# EAGLE design openusbfxs-dongle (EAGLE 5.03)
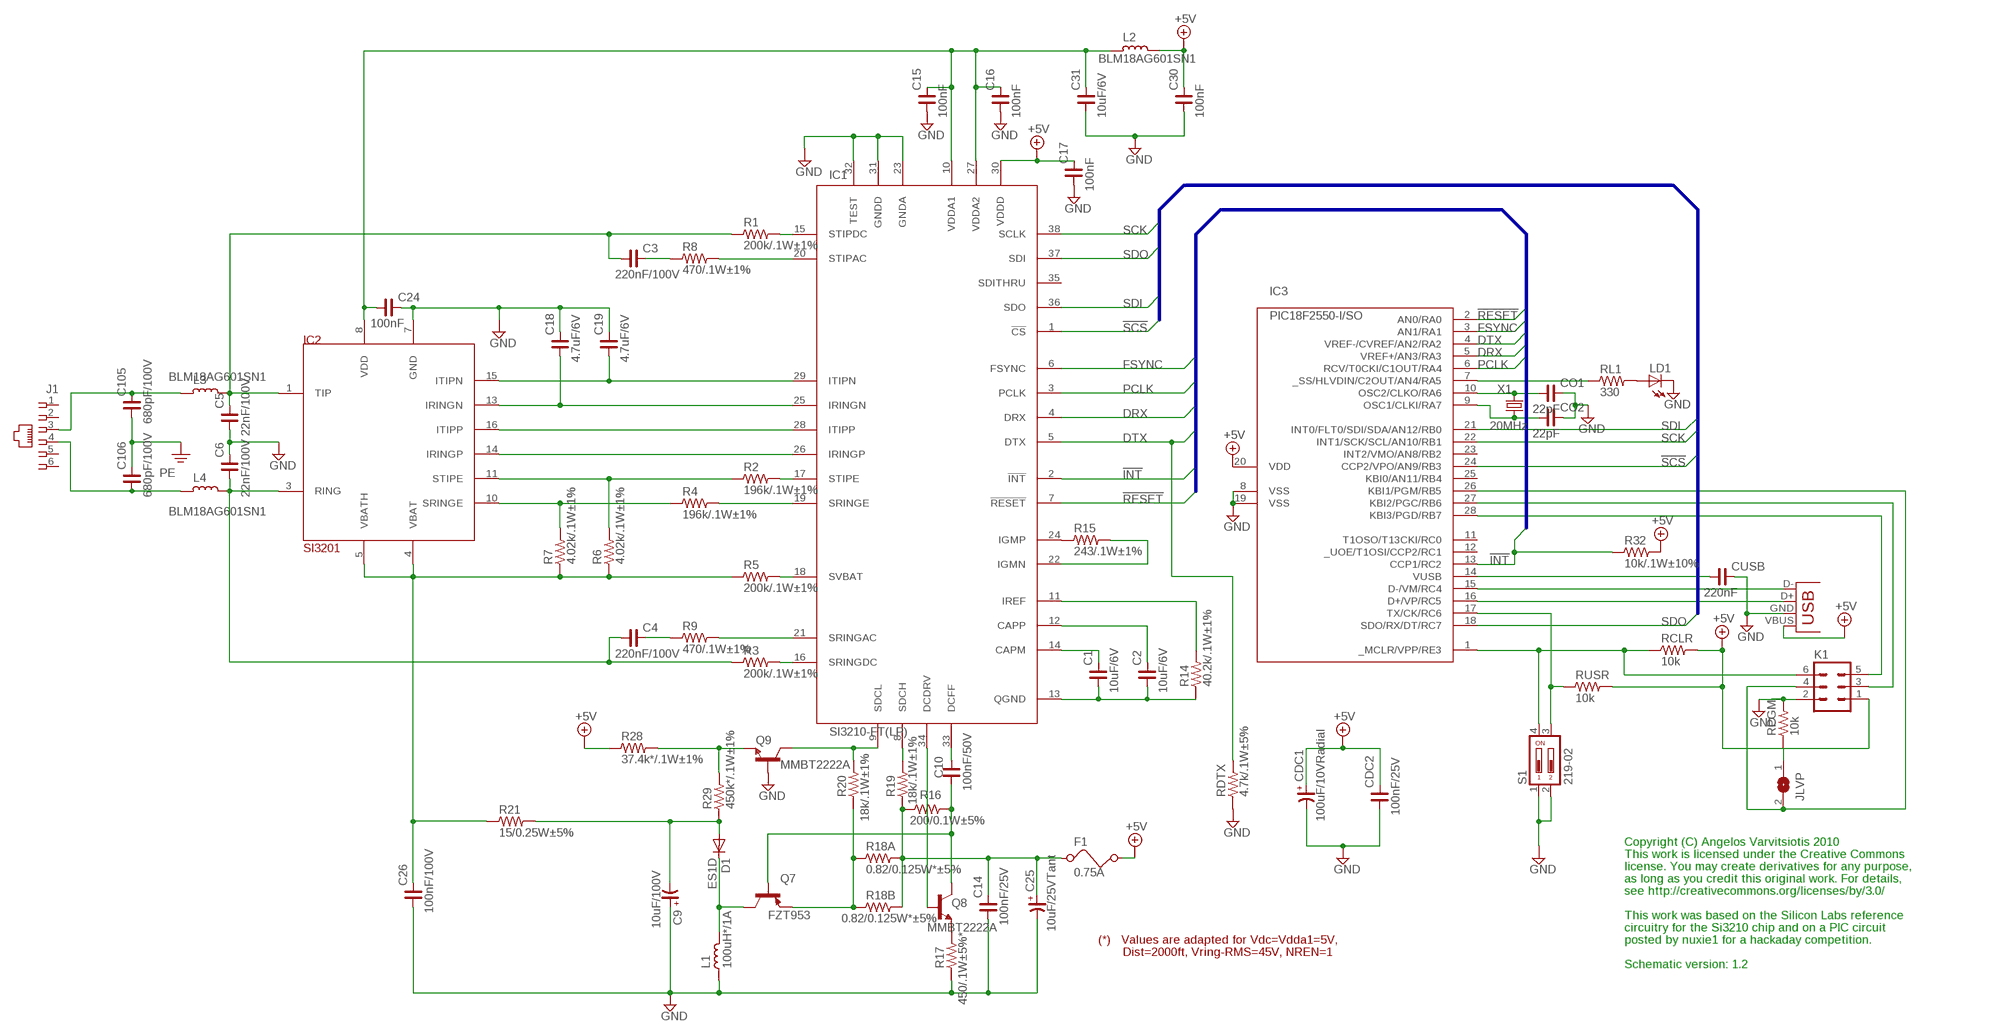
[diagram p0: schematic, sheet 1]

## Parts
C1  10uF/6V  C_1206  [C1206]
C2  10uF/6V  C_1206  [C1206]
C3  220nF/100V  C_1812  [C1812]
C4  220nF/100V  C_1812  [C1812]
C5  22nF/100V  C_1206  [C1206]
C6  22nF/100V  C_1206  [C1206]
C9  10uF/100V  CP_E-025X060  [CE-025X060]
C10  100nF/50V  C_1210  [C1210]
C14  100nF/25V  C_1210  [C1210]
C15  100nF  C_0603  [C0603]
C16  100nF  C_0603  [C0603]
C17  100nF  C_0603  [C0603]
C18  4.7uF/6V  C_1206  [C1206]
C19  4.7uF/6V  C_1206  [C1206]
C24  100nF  C_0603  [C0603]
C25  10uF/25VTant  CP_TT025-040  [CTT-025-040]
C26  100nF/100V  C_1210  [C1210]
C30  100nF  C_0603  [C0603]
C31  10uF/6V  C_1206  [C1206]
C105  680pF/100V  C_1206  [C1206]
C106  680pF/100V  C_1206  [C1206]
CDC1  100uF/10VRadial  CP_E-025X060  [CE-025X060]
CDC2  100nF/25V  C_1206  [C1206]
CO1  22pF  C_1206  [C1206]
CO2  22pF  C_1206  [C1206]
CUSB  220nF  C_1206  [C1206]
D1  ES1D  ES2D  [SMB]
F1  0.75A  FUSED  [1210]
IC1  SI3210-FT(LP)  [TSSOP38-LP]
IC2  SI3201  [ESOIC-16T]
IC3  PIC18F2550-I/SO  [SO-28W]
J1  RJ-11/12TH  [RJ-11/12]
JLVP  SJ  [SJ]
K1  MA03-2  [MA03-2]
L1  100uH*/1A  L_  [SMD_SC]
L2  BLM18AG601SN1  L_0603  [L0603]
L3  BLM18AG601SN1  L_0603  [L0603]
L4  BLM18AG601SN1  L_0603  [L0603]
LD1  LEDCHIPLED_1206  [CHIPLED_1206]
Q7  FZT953  PNP_SOT-223  [SOT230P700X160-4N]
Q8  MMBT2222A  NPN_SOT-23  [SOT95P280X135-3N]
Q9  MMBT2222A  NPN_SOT-23  [SOT95P280X135-3N]
R1  200k/.1W±1%  R_0805  [R0805]
R2  196k/.1W±1%  R_0805  [R0805]
R3  200k/.1W±1%  R_0805  [R0805]
R4  196k/.1W±1%  R_0805  [R0805]
R5  200k/.1W±1%  R_0805  [R0805]
R6  4.02k/.1W±1%  R_0805  [R0805]
R7  4.02k/.1W±1%  R_0805  [R0805]
R8  470/.1W±1%  R_0805  [R0805]
R9  470/.1W±1%  R_0805  [R0805]
R14  40.2k/.1W±1%  R_0805  [R0805]
R15  243/.1W±1%  R_0805  [R0805]
R16  200/0.1W±5%  R_0805  [R0805]
R17  450/.1W±5%*  R_0805  [R0805]
R18A  0.82/0.125W*±5%  R_1206  [R1206]
R18B  0.82/0.125W*±5%  R_1206  [R1206]
R19  18k/.1W±1%  R_0805  [R0805]
R20  18k/.1W±1%  R_0805  [R0805]
R21  15/0.25W±5%  R_1206  [R1206]
R28  37.4k*/.1W±1%  R_0805  [R0805]
R29  450k*/.1W±1%  R_0805  [R0805]
R32  10k/.1W±10%  R_0805  [R0805]
RCLR  10k  R_0805  [R0805]
RDTX  4.7k/.1W±5%  R_0805  [R0805]
RL1  330  R_1206  [R1206]
RPGM  10k  R_0805  [R0805]
RUSR  10k  R_0805  [R0805]
S1  219-02  [CTS-219-02]
U1  USB-A-H  [USB-A-H]
X1  20MHz  CRYTALHC49S  [HC49/S]

## Nets
!INT: IC1.2(!INT) IC3.13(CCP1/RC2) R32.1
!RESET: IC1.7(!RESET) IC3.2(AN0/RA0)
!SCS: IC1.1(!CS) IC3.24(CCP2/VPO/AN9/RB3)
+5V: C17.2 C30.2 CDC1.+ CDC2.2 F1.2 IC1.30(VDDD) IC3.20(VDD) K1.1 L2.1 R28.1 R32.2 RCLR.2 RUSR.2 U1.VBUS(GND)
\MCLR/VPP: IC3.1(_MCLR/VPP/RE3) K1.6 RCLR.1 S1.4
D+: IC3.16(D+/VP/RC5) U1.D+(D-)
D-: IC3.15(D-/VM/RC4) U1.D-(D+)
DCDRV: IC1.34(DCDRV) Q8.1(B)
DCFF: C10.2 IC1.33(DCFF)
DRX: IC1.4(DRX) IC3.5(VREF+/AN3/RA3)
DTX: IC1.5(DTX) IC3.4(VREF-/CVREF/AN2/RA2) RDTX.2
FSYNC: IC1.6(FSYNC) IC3.3(AN1/RA1)
GND: C5.1 C6.2 C9.+ C14.1 C15.1 C16.1 C17.1 C18.2 C19.2 C24.2 C25.- C26.1 C30.1 C31.1 C105.1 C106.2 CDC1.- CDC2.1 CO1.2 CO2.2 CUSB.2 IC1.23(GNDA) IC1.31(GNDD) IC1.32(TEST) IC2.7(GND) IC3.8(VSS) IC3.19(VSS) K1.2 L1.P$2 LD1.C Q9.1(B) R17.1 RDTX.1 RPGM.2 S1.1 S1.2 U1.GND(VBUS) ; supply symbol labelled PE
IRINGN: C18.1 IC1.25(IRINGN) IC2.13(IRINGN)
IRINGP: IC1.26(IRINGP) IC2.14(IRINGP)
ITIPN: C19.1 IC1.29(ITIPN) IC2.15(ITIPN)
ITIPP: IC1.28(ITIPP) IC2.16(ITIPP)
N$1: IC1.15(STIPDC) R1.2
N$2: IC1.17(STIPE) R2.2
N$3: IC1.18(SVBAT) R5.2
N$4: IC1.19(SRINGE) R4.2
N$5: IC1.16(SRINGDC) R3.2
N$13: IC1.20(STIPAC) R8.2
N$14: IC1.21(SRINGAC) R9.2
N$15: LD1.A RL1.2
N$18: C1.1 C2.1 IC1.13(QGND) R14.1
N$19: C1.2 IC1.14(CAPM)
N$20: C2.2 IC1.12(CAPP)
N$21: IC1.11(IREF) R14.2
N$22: C3.2 R8.1
N$23: C4.2 R9.1
N$24: IC1.24(IGMP) R15.1
N$25: Q8.2(E) R17.2
N$26: C9.- D1.A R21.2 R29.1
N$27: Q9.2(E) R28.2 R29.2
N$30: Q7.3(E) R18A.1 R18B.1 R20.1
N$36: C10.1 Q7.1(B) Q8.3(C) R16.2
N$37: D1.C L1.P$1 Q7.2(C)
N$42: JLVP.1 RPGM.1
N$43: CO1.1 IC3.10(OSC2/CLKO/RA6) X1.2
N$44: CO2.1 IC3.9(OSC1/CLKI/RA7) X1.1
N$45: CUSB.1 IC3.14(VUSB)
N$46: C105.2 J1.3 L3.2
N$47: C106.1 J1.4 L4.2
N$48: IC3.7(_SS/HLVDIN/C2OUT/AN4/RA5) RL1.1
N$50: IC3.17(TX/CK/RC6) RUSR.1 S1.3
PCLK: IC1.3(PCLK) IC3.6(RCV/T0CKI/C1OUT/RA4)
PGC: IC3.27(KBI2/PGC/RB6) K1.3
PGD: IC3.28(KBI3/PGD/RB7) K1.5
PGM: IC3.26(KBI1/PGM/RB5) JLVP.2 K1.4
R15: IC1.22(IGMN) R15.2
SCK: IC1.38(SCLK) IC3.22(INT1/SCK/SCL/AN10/RB1)
SDCH: IC1.8(SDCH) R19.2
SDCL: IC1.9(SDCL) Q9.3(C) R20.2
SDI: IC1.36(SDO) IC3.21(INT0/FLT0/SDI/SDA/AN12/RB0)
SDO: IC1.37(SDI) IC3.18(SDO/RX/DT/RC7)
SRINGDC: C4.1 C6.1 IC2.3(RING) L4.1 R3.1
SRINGE: IC2.10(SRINGE) R4.1 R7.2
STIPDC: C3.1 C5.2 IC2.1(TIP) L3.1 R1.1
STIPE: IC2.11(STIPE) R2.1 R6.2
VANALOG: C15.2 C16.2 C24.1 C31.2 IC1.10(VDDA1) IC1.27(VDDA2) IC2.8(VDD) L2.2
VBAT: C26.2 IC2.4(VBAT) IC2.5(VBATH) R5.1 R6.1 R7.1 R21.1
VUNREG: C14.2 C25.+ F1.1 R16.1 R18A.2 R18B.2 R19.1
Unconnected: IC1.35(SDITHRU) IC3.11(T1OSO/T13CKI/RC0) IC3.12(_UOE/T1OSI/CCP2/RC1) IC3.23(INT2/VMO/AN8/RB2) IC3.25(KBI0/AN11/RB4) J1.1 J1.2 J1.5 J1.6

## Buses
SPI:SDI,SDO,SCK,!SCS
PCM:FSYNC,PCLK,DRX,DTX,!RESET,!INT

## Notes on the sheet
- Copyright (C) Angelos Varvitsiotis 2010
- This work is licensed under the Creative Commons
- license. You may create derivatives for any purpose,
- as long as you credit this original work. For details,
- see http://creativecommons.org/licenses/by/3.0/
- This work was based on the Silicon Labs reference
- circuitry for the Si3210 chip and on a PIC circuit
- (*)   Values are adapted for Vdc=Vdda1=5V, | posted by nuxie1 for a hackaday competition.
- Dist=2000ft, Vring-RMS=45V, NREN=1
- Schematic version: 1.2

## Library data of the parts
C1-C6 C10 C14-C19 C24 C26 C30 C31 C105 C106 CDC2 CO1 CO2 CUSB = rc-master:C_: NON-POLARIZED CAP
C9 C25 CDC1 = rc-master:CP_: POLARIZED CAP
D1 = diode:ES2D: DIODE super fast rectifier, 2 A
F1 = m-pad-2.0:FUSE: Fuse's in various packages
IC1 = SilabsProSLIC:SI3210: Si3210 ProSLIC® IC Silicon Labs Si3210 ProSLIC® IC; DC-DC_TYPE: BJT; ROHS: YES
IC2 = SilabsProSLIC:SI3201: Si3201 Linefeed Interface IC Silicon Labs 3201 Linefeed Interface IC
IC3 = microchip-pic18fxx5x:PIC18*2550: PIC18*2550 Microchip FLASH Microcontroller with FS-USB DEVICE FEATURES Feature PIC18*2550 Program Memory (bytes) 32k Program Memory (instructions) 16384 I/O Ports Ports A, B, C, (E) Capture/Compare/PWM Modules 2 Enhanced Capture/Compare/PWM Modules 0 Parallel Communications (PSP) No 10-bit Analog-to-Digital Module 10 input Channels Package Types 28-pin PDIP 28-pin SOIC NOTES: F only after 18, means standard voltage range from 4.2v to 5.5v LF after 18, means extended voltage range from 2.0v to 5.5v T after entire device number, means supplied in tape and reel TQFP packages only -E before / denotes extended temperature range from -40°C to +120°C -I before / denotes industrial temperature range from -40°C to +85°C /PT suffix denotes TQFP package /SO suffix denotes SOIC package /SP suffix denotes Skinny Plastic DIP package /P suffix denotes Plastic DIP package /ML suffix denotes QFN package
J1 = connectors:RJ-11/12: 6 Pin RJ-12 Connector Digikey Part Number: A9031-ND
JLVP = jumper:SJ: SMD solder JUMPER
K1 = con-lstb:MA03-2: PIN HEADER
L1 = ShieldedChoke:L_: INDUCTOR
L2-L4 = rc-master:L_: INDUCTOR
LD1 = led:LED: LED OSRAM: - CHIPLED LG R971, LG N971, LY N971, LG Q971, LY Q971, LO R971, LY R971 LH N974, LH R974 LS Q976, LO Q976, LY Q976 LO Q996 - Hyper CHIPLED LW Q18S LB Q993, LB Q99A, LB R99A - SideLED LS A670, LO A670, LY A670, LG A670, LP A670 LB A673, LV A673, LT A673, LW A673 LH A674 LY A675 LS A676, LA A676, LO A676, LY A676, LW A676 LS A679, LY A679, LG A679 - Hyper Micro SIDELED® LS Y876, LA Y876, LO Y876, LY Y876 LT Y87S - SmartLED LW L88C, LW L88S LB L89C, LB L89S, LG L890 LS L89K, LO L89K, LY L89K LS L896, LA L896, LO L896, LY L896 - TOPLED LS T670, LO T670, LY T670, LG T670, LP T670 LSG T670, LSP T670, LSY T670, LOP T670, LYG T670 LG T671, LOG T671, LSG T671 LB T673, LV T673, LT T673, LW T673 LH T674 LS T676, LA T676, LO T676, LY T676, LB T676, LH T676, LSB T676, LW T676 LB T67C, LV T67C, LT T67C, LS T67K, LO T67K, LY T67K, LW E67C LS E67B, LA E67B, LO E67B, LY E67B, LB E67C, LV E67C, LT E67C LW T67C LS T679, LY T679, LG T679 LS T770, LO T770, LY T770, LG T770, LP T770 LB T773, LV T773, LT T773, LW T773 LH T774 LS E675, LA E675, LY E675, LS T675 LS T776, LA T776, LO T776, LY T776, LB T776 LHGB T686 LT T68C, LB T68C - Hyper Mini TOPLED® LB M676 - Mini TOPLED Santana® LG M470 LS M47K, LO M47K, LY M47K Source: http://www.osram.convergy.de LUXEON: - LUMILED® LXK2-PW12-R00, LXK2-PW12-S00, LXK2-PW14-U00, LXK2-PW14-V00 LXK2-PM12-R00, LXK2-PM12-S00, LXK2-PM14-U00 LXK2-PE12-Q00, LXK2-PE12-R00, LXK2-PE12-S00, LXK2-PE14-T00, LXK2-PE14-U00 LXK2-PB12-K00, LXK2-PB12-L00, LXK2-PB12-M00, LXK2-PB14-N00, LXK2-PB14-P00, LXK2-PB14-Q00 LXK2-PR12-L00, LXK2-PR12-M00, LXK2-PR14-Q00, LXK2-PR14-R00 LXK2-PD12-Q00, LXK2-PD12-R00, LXK2-PD12-S00 LXK2-PH12-R00, LXK2-PH12-S00 LXK2-PL12-P00, LXK2-PL12-Q00, LXK2-PL12-R00 Source: www.luxeon.com KINGBRIGHT: KA-3528ASYC Source: www.kingbright.com
Q7 = ipc-7351-transistor:PNP_
Q8 Q9 = ipc-7351-transistor:NPN_
R1-R9 R14-R17 R18A R18B R19-R21 R28 R29 R32 RCLR RDTX RL1 RPGM RUSR = rc-master:R_: RESISTOR
S1 = switch-dil:219-02*: Surface Mount DIP Switch Series 219 SMT CTS Electronic Components Sourc: www.ctscorp.com
U1 = SparkFun:USB: USB Connectors USB-B-PTH is fully proven SKU : PRT-00139 USB-miniB is fully proven SKU : PRT-00587 USB-A-PCB is untested. USB-A-H is throughly reviewed, but untested. Spark Fun Electronics SKU : PRT-00437 USB-B-SMT is throughly reviewed, but untested. Needs silkscreen touching up. USB-A-S has not been used/tested USB-MB-H has not been used/tested
X1 = crystal:CRYTAL: CRYSTAL

## Board
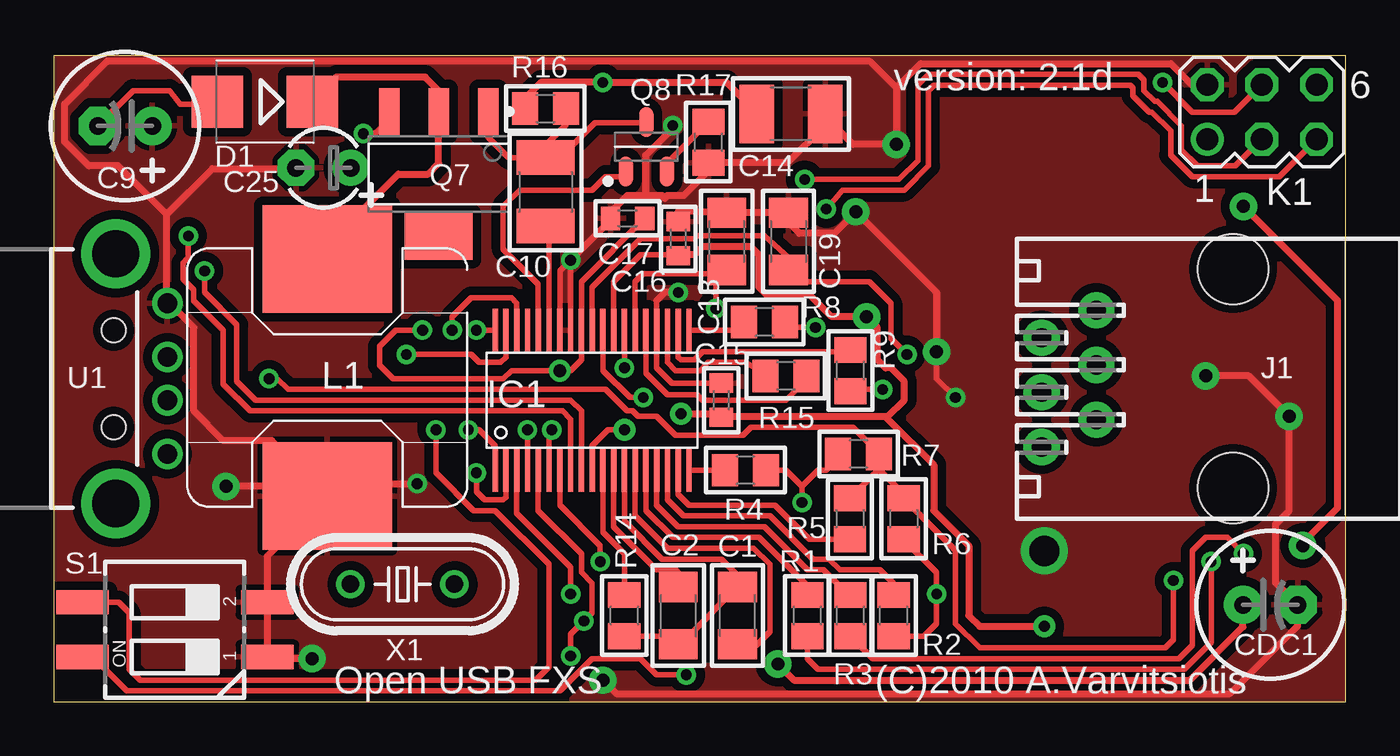
[diagram p1: board, top side]
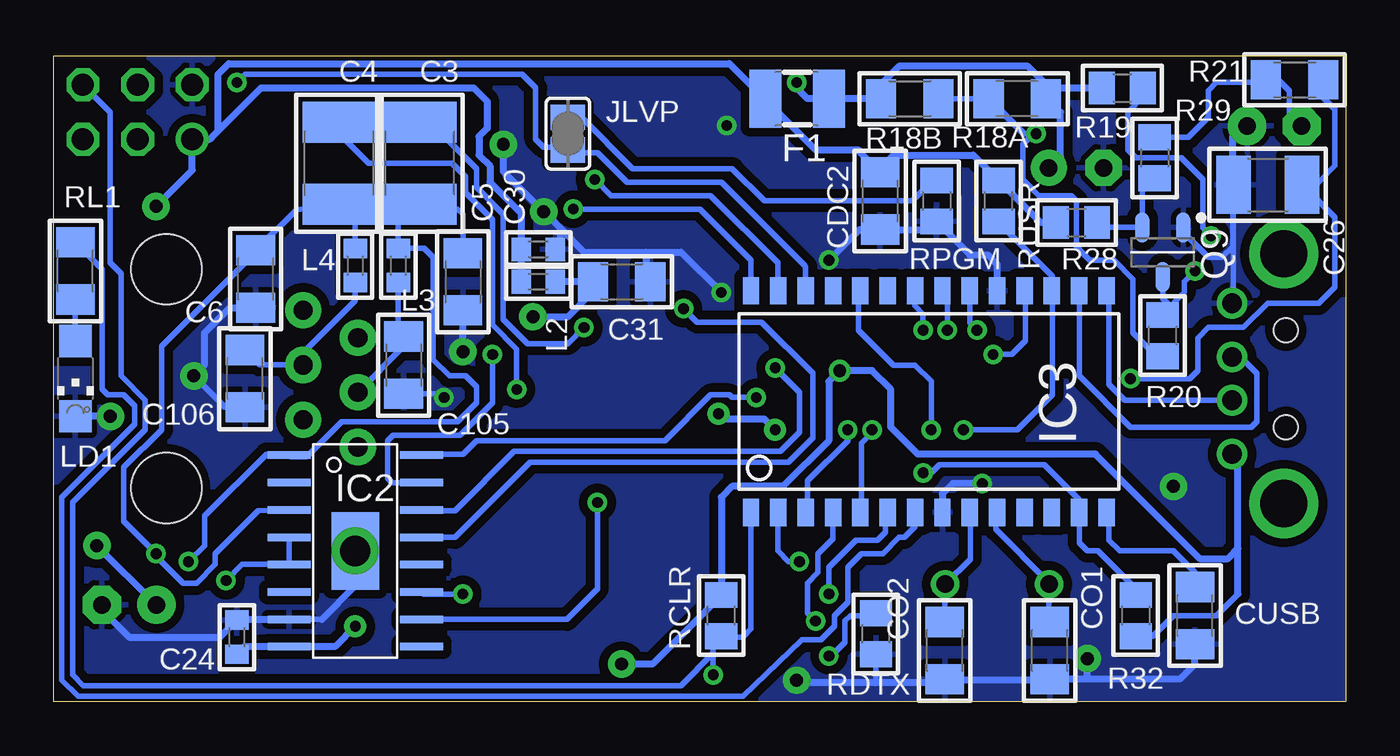
[diagram p2: board, bottom side, seen from below]

Size 60 x 30 mm. Coordinates in mm from the lower left corner, seen from the top.
Outline: 0,0 60,0 60,30 0,30 0,0
Copper layers (1*16): Top 0.035mm / dielectric 1.5mm / Bottom 0.035mm
Design rules "default *": minimum track width 0.25mm, minimum drill 0.5mm, track to track 8mil, track to pad 8mil, pad to pad 8mil, via to via 8mil, smd to smd 8mil, copper to edge 0mil, drill to drill 0.4mm, minimum pad ring 10mil, minimum via ring 8mil, stop-mask expansion 4mil, vias tented up to drill 0mil, thermal gap 10mil

### Footprints (pad centres in the part's own frame; a part is rotated, then mirrored left to right if it is on the bottom)
C1206 = smd 1.4 x 1.8: 1 -1.329,0; 2 1.329,0
C1812 = smd 1.905 x 3.404: 1 -1.905,0; 2 1.905,0
CE-025X060 = drill 0.813 pad 1.778 round: + -1.27,0 | drill 0.813 pad 1.778 octagon: - 1.27,0
C1210 = smd 1.6 x 2.7: 1 -1.587,0; 2 1.587,0
C0603 = smd 0.9 x 1.1: 1 -0.794,0; 2 0.794,0
CTT-025-040 = drill 0.813 pad 1.676 round: + -1.27,0 | drill 0.813 pad 1.676 octagon: - 1.27,0
SMB = smd 2.4 x 2.4: A 2.2,0; C -2.2,0
1210 = smd 1.5 x 2.7: 1 -1.5,0; 2 1.45,0
TSSOP38-LP = smd 0.25 x 2: 1 -4.5,-3.25; 2 -4,-3.25; 3 -3.5,-3.25; 4 -3,-3.25; 5 -2.5,-3.25; 6 -2,-3.25; 7 -1.5,-3.25; 8 -1,-3.25; 9 -0.5,-3.25; 10 0,-3.25; 11 0.5,-3.25; 12 1,-3.25; 13 1.5,-3.25; 14 2,-3.25; 15 2.5,-3.25; 16 3,-3.25; 17 3.5,-3.25; 18 4,-3.25; 19 4.5,-3.25; 20 4.5,3.25; 21 4,3.25; 22 3.5,3.25; 23 3,3.25; 24 2.5,3.25; 25 2,3.25; 26 1.5,3.25; 27 1,3.25; 28 0.5,3.25; 29 0,3.25; 30 -0.5,3.25; 31 -1,3.25; 32 -1.5,3.25; 33 -2,3.25; 34 -2.5,3.25; 35 -3,3.25; 36 -3.5,3.25; 37 -4,3.25; 38 -4.5,3.25
ESOIC-16T = smd 0.35 x 2: 1 -4.445,-3.075; 2 -3.175,-3.075; 3 -1.905,-3.075; 4 -0.635,-3.075; 5 0.635,-3.075; 6 1.905,-3.075; 7 3.175,-3.075; 8 4.445,-3.075; 9 4.445,3.075; 10 3.175,3.075; 11 1.905,3.075; 12 0.635,3.075; 13 -0.635,3.075; 14 -1.905,3.075; 15 -3.175,3.075; 16 -4.445,3.075 | smd 3.6 x 2.2: THERMAL 0,0
SO-28W = smd 0.762 x 1.27: 1 -7.62,-5.207; 2 -6.35,-5.207; 3 -5.08,-5.207; 4 -3.81,-5.207; 5 -2.54,-5.207; 6 -1.27,-5.207; 7 0,-5.207; 8 1.27,-5.207; 9 2.54,-5.207; 10 3.81,-5.207; 11 5.08,-5.207; 12 6.35,-5.207; 13 7.62,-5.207; 14 8.89,-5.207; 15 8.89,5.08; 16 7.62,5.08; 17 6.35,5.08; 18 5.08,5.08; 19 3.81,5.08; 20 2.54,5.08; 21 1.27,5.08; 22 0,5.08; 23 -1.27,5.08; 24 -2.54,5.08; 25 -3.81,5.08; 26 -5.08,5.08; 27 -6.35,5.08; 28 -7.62,5.08
RJ-11/12 = drill 0.889 pad 1.676 round: 1 -3.175,7.747; 2 -1.905,5.207; 3 -0.635,7.747; 4 0.635,5.207; 5 1.905,7.747; 6 3.175,5.207 | hole 3.251: -5.08,-1.143; 5.08,-1.143
SJ = smd 1.168 x 1.6: 1 -0.762,0; 2 0.762,0
MA03-2 = drill 1.016 round: 1 -2.54,-1.27 | drill 1.016 octagon: 2 -2.54,1.27; 3 0,-1.27; 4 0,1.27; 5 2.54,-1.27; 6 2.54,1.27
SMD_SC = smd 5 x 6: P$1 -5.5,0; P$2 5.5,0
L0603 = smd 0.9 x 1.1: 1 -0.794,0; 2 0.794,0
CHIPLED_1206 = smd 1.5 x 1.5: A 0,-1.75; C 0,1.75
SOT230P700X160-4N = smd 2.15 x 0.95: 1 -2.9,2.3; 2 -2.9,0; 3 -2.9,-2.3 | smd 2.15 x 3.15: 4 2.9,0
SOT95P280X135-3N = smd 1.4 x 0.65: 1 -1.15,0.95; 2 -1.15,-0.95; 3 1.15,0
R0805 = smd 1.2 x 1.5: 1 -0.953,0; 2 0.953,0
R1206 = smd 1.4 x 1.8: 1 -1.329,0; 2 1.329,0
CTS-219-02 = smd 1.13 x 2.44: 1 -1.27,-4.3; 2 1.27,-4.3; 3 1.27,4.3; 4 -1.27,4.3
USB-A-H = drill 0.914 round: D+ 2.4,1; D- 2.4,-1; GND 2.4,3.5; VBUS 2.4,-3.5 | drill 2.2 round: GND@1 0,5.8; GND@2 0,-5.8 | hole 1.1: -0.1,2.25; -0.1,-2.25
HC49/S = drill 0.813 round: 1 -2.413,0; 2 2.413,0

### Placement (x,y rotation side)
C1  31.75,4 270 top
C2  29,4 90 top
C3  43,25 90 bottom
C4  46.75,25 90 bottom
C5  41,19.5 90 bottom
C6  50.62,19.62 270 bottom
C9  3.31,26.73 180 top
C10  22.84,23.67 270 top
C14  34.24,27.29 180 top
C15  31,14 270 top
C16  29,21.5 270 top
C17  26.65,22.44 0 top
C18  31.25,21.38 90 top
C19  34.12,21.38 90 top
C24  51.5,3 90 bottom
C25  12.52,24.79 180 top
C26  3.62,24 0 bottom
C30  37.5,21 180 bottom
C31  33.62,19.5 180 bottom
C105  43.75,15.62 90 bottom
C106  51.12,15 270 bottom
CDC1  56.5,4.5 0 top
CDC2  21.62,23.25 90 bottom
CO1  13.75,2.38 270 bottom
CO2  18.62,2.38 270 bottom
CUSB  7,4 270 bottom
D1  9.8,27.86 180 top
F1  25.5,28 180 bottom
IC1  25,14 0 top
IC2  46,7 270 bottom
IC3  20,14 0 bottom
J1  53.62,15 90 top
JLVP  36.12,26.38 270 bottom
K1  56.11,27.38 0 top
L1  12.7,15.05 270 top
L2  37.5,19.5 0 bottom
L3  44,20.25 270 bottom
L4  46,20.25 270 bottom
LD1  59,15 180 bottom
Q7  17.88,24.5 270 top
Q8  27.52,25.77 90 top
Q9  8.5,20.88 270 bottom
R1  35,4 90 top
R2  39,4 90 top
R3  37,4 90 top
R4  32.12,10.75 180 top
R5  36.98,8.49 270 top
R6  39.47,8.49 270 top
R7  37.38,11.5 180 top
R8  33,17.62 180 top
R9  37,15.38 90 top
R14  26.5,4 90 top
R15  34,15.12 180 top
R16  22.84,27.54 0 top
R17  30.41,25.98 90 top
R18A  15.25,28 0 bottom
R18B  20.25,28 180 bottom
R19  10.38,28.5 0 bottom
R20  8.5,17 90 bottom
R21  2.38,28.88 180 bottom
R28  12.5,22.25 0 bottom
R29  8.88,25.25 270 bottom
R32  9.75,4 270 bottom
RCLR  29,4 90 bottom
RDTX  21.82,3.15 90 bottom
RL1  59,20 270 bottom
RPGM  19,23.25 270 bottom
RUSR  16.12,23.25 90 bottom
S1  5.62,3.35 90 top
U1  2.88,15 0 top
X1  16.2,5.46 180 top

### Tracks (layer width: path | path; a pad name or v marks a point on that pad's centre or on a via)
!INT  (via drill 0.5)
  Top 0.25: IC1.2 21,9.5 20.88,9.38 20,9.38 19.62,9.75 v19.62,10.62
  Bottom 0.25: R32.1 9.75,5.25 11.5,7 12,7 12.38,7.38 IC3.13 12.38,9.38 14,11 18.88,11 19.25,10.62 v19.62,10.62
!RESET  (via drill 0.5)
  Top 0.25: IC1.7 23.5,9.12 25.38,7.25 v25.38,6.5
  Bottom 0.25: IC3.2 26.38,8.77 26.38,7 25.88,6.5 v25.38,6.5
!SCS  (via drill 0.5 pad 0.25)
  Top 0.25: IC1.1 20.5,11.88 19.75,12.62 v19.25,12.62
  Bottom 0.25: IC3.24 22.62,19 22.62,18.5 22.62,17.25 21,15.62 20,15.62 19.25,14.88 v19.25,12.62
+5V  (via drill 0.5, 0.6 pad 1.02, 0.6 pad 1.27)
  Top 0.25: C17.2 24.5,19.5 IC1.30 24.5,15.88 24,15.38 v23.5,15.38 21.25,15.38 20.88,15 15.75,15 15.12,15.62 15.12,16.5 15.88,17.25 v17.12,17.25
  Top 0.33: v33.62,1.75 34.38,1 52.75,1 55.23,3.48 CDC1.+ | v55.25,23 59.62,18.62 59.62,9 58,7.38 v58,7.25
  Bottom 0.25: IC3.20 17.46,17.59 v17.12,17.25 | 5,5 6,4 8,4 8.95,3.05 R32.2 | 21.67,24.62 CDC2.2 | F1.2 26.95,27.7 | K1.1 53.55,26.12
  Bottom 0.33: v55.25,23 53.62,24.62 53.57,24.68 K1.1 | R28.1 14.17,22.25 RUSR.2 17.3,25.38 21,25.38 21.62,24.75 CDC2.2 | v33.62,1.75 32.2,1.75 RCLR.2 29,9.5 28.5,10 26.12,10 24,12.12 24,14.88 v23.5,15.38 22,15.38 21.12,14.5 21.12,12.75 19.88,11.5 11.62,11.5 6.75,6.62 5.5,6.62 5,7.12 | U1.VBUS 5,11.22 5,7.12 | 5,5 5,7.12 | 21.67,24.62 22.62,25.58 22.62,25.62 24.62,25.62 26.95,27.95 F1.2 27,28 28.62,29.62 51.88,29.62 52.38,29.12 52.38,26.5 52.5,26.38 | 53.55,26.12 52.75,26.12 52.5,26.38 | L2.1 C30.2 38.29,22.67 39.75,24.12 39.75,24.88 40.25,25.38 40.25,26.25 39.88,26.62 39.88,27.88 40.5,28.5 50.38,28.5 52.5,26.38 | v58,7.25 55.25,4.5 CDC1.+
\MCLR/VPP  (via drill 0.5)
  Top 0.25: S1.4 1.79,2.08 3.38,0.5 23.5,0.5 25,2 27.25,2 28,1.25 v29.38,1.25
  Bottom 0.25: IC3.1 27.62,3.38 28,3 28.95,3 RCLR.1 29.38,2.67 29.38,2.25 | 29.38,2.25 30.88,0.75 58.62,0.75 59.12,1.25 59.12,9.25 55.75,12.62 55.75,14 56.88,15.12 56.88,19.88 57.38,20.38 57.38,27.38 K1.6 | v29.38,1.25 29.38,2.25
D+
  Bottom 0.25: U1.D+ 4.88,16 4.12,15.25 4.12,13 4.38,12.75 10,12.75 12.38,15.12 IC3.16
D-
  Bottom 0.25: U1.D- 10.25,14 11,14.75 11,18.97 IC3.15
DCDRV
  Top 0.25: IC1.34 22.5,19.38 20.88,21 20.88,23 21.62,23.75 25,23.75 25.62,24.38 26.57,24.38 Q8.1
DCFF
  Top 0.25: IC1.33 23,21.99 C10.2
DRX  (via drill 0.5 pad 0.25)
  Top 0.25: v22,12.62 IC1.4
  Bottom 0.25: 22.5,8.75 IC3.5 22.5,8.83 22.5,12 22,12.5 v22,12.62
DTX  (via drill 0.5)
  Top 0.25: IC1.5 22.5,8.88 24.5,6.88 24.5,6 25,5.5 25,4.12 v24.62,3.75 24,3.12 v24,2.12
  Bottom 0.25: IC3.4 23.75,8.73 23.81,8.67 23.81,7.56 24.5,6.88 24.5,6 25,5.5 25,4.12 v24.62,3.75 | RDTX.2 21.92,4 22.75,4 23,4 23.25,3.75 23.25,2.75 23.88,2.12 v24,2.12
FSYNC  (via drill 0.5 pad 0.25)
  Top 0.25: IC1.6 23,12.5 v23.12,12.62
  Bottom 0.25: IC3.3 25,8.87 25,10.25 23.12,12.12 v23.12,12.62
GND  (via drill 0.5, 0.6 pad 1.27, 1.4 pad 2.18)
  Top 0.25: C15.1 28.71,14.79 28,15.5 IC1.23 28,18.62 | 25.88,22.38 25.88,22.42 C17.1 25.86,22.36 | U1.GND 5.25,18.52 | IC1.31 v24,20.5 23.5,20 IC1.32 | 33.91,22.46 C19.2 | 34.09,25.03 32.36,25 | 10,2 S1.1 | 11.21,24.75 C25.- | 28.75,26.62 v28.75,26.75 | 27.62,23.5 27.5,23.62 | 53.62,28.62 53.59,28.62 K1.2 | 36,27 36,27.12 C14.1 | v41.88,14.12 41,15 v41,16.25
  Top 0.33: 25.88,22.42 25.88,22.75 26.62,23.5 27.62,23.5 28.25,23.5 28.38,23.38 28.5,23.5 29.25,23.5 30.41,24.66 R17.1 34.09,25.03 35.83,26.77 C14.1 | C16.1 29,22.75 29.02,22.77 C18.2 C19.2 | 28,18.62 28.38,19 v29,19 | 5.25,18.52 5.25,22.62 | 25.86,22.36 v24,20.5 | 33.91,22.46 34.62,21.75 36.25,21.75 v37.25,22.75 41,19 v41,16.25 | 12.12,10.12 L1.P$2 9.92,6.77 S1.2 S1.1 | 12.12,10.12 11.12,11.12 | 11.12,11.12 10.12,12.12 7.88,12.12 6.5,13.5 6.5,17.38 5.38,18.5 U1.GND | 12.12,10.12 v16.88,10.12 | 39.12,28.5 v39.12,25.88 37.12,25.88 36,27 | 39.12,28.5 40.25,29.62 51.88,29.62 52.88,28.62 53.62,28.62 | v12,2 10,2 | 11.21,24.75 7.38,24.75 5.25,22.62 | 5.25,22.62 3,24.88 1.62,24.88 0.5,26 0.5,27.75 2.5,29.75 37.88,29.75 39.12,28.5 | v25.5,1 26.12,0.38 54.62,0.38 57.77,3.52 CDC1.- 56.75,5.52 56.75,8.25 57.38,8.88 v57.38,13.25 55.5,15.12 v53.5,15.12 | v8,10 10,10 11.12,11.12 | 28.75,26.62 27.5,25.38 27.5,23.62
  Bottom 0.25: v29,19 29.25,19 | 4.77,26.73 C9.+ | U1.GND 5.21,18.56 C26.1 5.25,24.04 5.25,21.12 5.75,20.62 6.38,20.62 7.55,21.8 Q9.1 | 21.25,21.92 CDC2.1 22.58,21.92 | 19.38,21.92 RPGM.2 | 49.11,3.79 IC2.7 47.55,3.83 | C105.1 42.05,14.3 v41.88,14.12 | C106.2 52.05,13.67 v53.5,15.12 | RDTX.1 21.82,0.93 21.88,0.88
  Bottom 0.33: 4.77,26.73 5.25,26.25 5.25,24.04 | IC3.19 16.19,20.32 16.62,20.75 17.45,20.75 RPGM.2 | v24,20.5 22.58,21.92 | v29,19 30.88,20.88 32.5,20.88 | IC3.8 18.73,9.64 18.25,10.12 v16.88,10.12 | 12,1.05 7.7,1.05 7,1.75 CUSB.2 | 12,1.05 CO1.2 13.8,1 18.62,1 CO2.2 | v39.12,25.88 39.12,24.62 v37.25,22.75 36.5,22 | 12,1.05 v12,2 | 21.25,21.92 19.38,21.92 | CO2.2 18.8,0.88 | CO2.2 18.8,0.88 | 36.5,22 35.38,20.88 32.5,20.88 | 18.8,0.88 21.88,0.88 25.5,0.88 v25.5,1 | C30.1 36.5,21.21 36.5,22 | C31.1 32.5,19.7 32.5,20.88 | v41,16.25 C5.1 | C6.2 51.83,18.3 53,17.12 53,15.62 v53.5,15.12 | CDC1.- 57.77,4.27 56.5,3 52.29,3 C24.2 51.47,3.83 IC2.7 | v57.38,13.25 LD1.C | 47.55,3.83 46,5.38
  other vias: 46,7
  pour Top (isolate 0.406): 0.12,0.12 0.12,29.88 59.88,29.88 59.88,0.12
  pour Bottom (isolate 0.406): 0.12,0.12 0.12,29.88 59.88,29.88 59.88,0.12
IRINGN  (via drill 0.5)
  Top 0.25: IC1.25 27,19.5 27.38,19.88 30.99,19.88 C18.1 30.75,19.55 v30.75,18.25
  Bottom 0.25: v30.75,18.25 30.12,17.62 27.12,17.62 24.75,15.25 24.75,12.25 25.88,11.12 37.88,11.12 41.38,7.62 IC2.13
IRINGP  (via drill 0.5)
  Top 0.25: v26.5,15.5 IC1.26
  Bottom 0.25: v26.5,15.5 25.38,14.38 25.38,12.5 26.25,11.62 38.62,11.62 41.38,8.88 42.9,8.88 | 42.9,8.88 IC2.14 42.9,8.88
ITIPN  (via drill 0.5)
  Top 0.25: IC1.29 25,19.25 27.25,21.5 29.75,21.5 29.88,21.62 33,21.62 34.16,20.59 C19.1 34.67,19.5 37.88,19.5 38.88,18.5 38.88,16.88 v39.62,16.12
  Bottom 0.25: IC2.15 44.3,10.18 44.5,10.38 44.5,12.12 44.25,12.38 41.12,12.38 39.62,13.88 v39.62,16.12
ITIPP  (via drill 0.5)
  Top 0.25: IC1.28 25.5,15.38 26.75,14.12 v27.38,14.12
  Bottom 0.25: v27.38,14.12 28.5,14.12 28.62,14.25 29.5,14.25 31.62,12.12 40.38,12.12 41,11.5 42.87,11.5 IC2.16
N$1
  Top 0.25: IC1.15 27.5,8.88 28.75,7.62 32.75,7.62 35,5.38 R1.2
N$2
  Top 0.25: IC1.17 28.5,9.38 29.25,8.62 33.25,8.62 35.25,6.62 36,6.62 36.5,6.12 38.38,6.12 39,5.5 R2.2
N$3
  Top 0.25: IC1.18 29,9.62 29.5,9.12 33.5,9.12 35.09,7.54 R5.2
N$4
  Top 0.25: IC1.19 30.38,10.75 30.8,10.75 R4.2
N$5
  Top 0.25: IC1.16 28,9.12 29,8.12 33,8.12 35,6.12 35.75,6.12 36.92,4.95 R3.2
N$13
  Top 0.25: IC1.20 31.62,17.25 31.67,17.25 R8.2
N$14
  Top 0.25: IC1.21 29,16 29.12,15.88 29.75,15.88 30.12,16.25 36.92,16.25 R9.2
N$15
  Bottom 0.25: LD1.A RL1.2
N$18
  Top 0.25: IC1.13 26.5,8.38 28.25,6.62 31,6.62 31.75,5.88 C1.1 | C1.1 31.75,5.75 | R14.1 28.62,3.05 | 28.62,3.05 C2.1 | 28.62,3.05 29.47,3.05 C1.1
N$19
  Top 0.25: IC1.14 27,8.62 28.5,7.12 32.5,7.12 33.25,6.38 33.25,3.38 33.25,3.25 32.62,2.62 31.8,2.62 C1.2
N$20
  Top 0.25: IC1.12 26,8.12 28,6.12 28.88,6.12 29,6 29,5.43 C2.2
N$21
  Top 0.25: 26.5,5 R14.2 26.5,6.88 25.5,7.88 IC1.11
N$22  (via drill 0.5)
  Top 0.25: R8.1 34.2,17.38 v35.38,17.38
  Bottom 0.25: v35.38,17.38 36.12,16.62 38,16.62 39.12,17.75 39.12,22.62 40.38,23.88 40.38,24.75 42.25,26.62 42.84,26.62 C3.2
N$23  (via drill 0.5)
  Top 0.25: v38.5,14.5 37.08,14.5 R9.1
  Bottom 0.25: C4.2 46.75,26.38 45.38,25 41.5,25 40.88,24.38 40.88,23.62 39.62,22.38 39.62,17.5 38.5,16.38 v38.5,14.5
N$24
  Top 0.25: IC1.24 27.5,15.25 28.5,14.25 29.88,14.25 30.12,14 34,14 35.08,15.08
  Top 0.33: 35.08,15.08 35,15.08 R15.1
N$25
  Top 0.25: Q8.2 28.47,25 R17.2
N$26
  Top 0.25: C9.- 3.69,28.38 5.38,28.38 5.88,27.75 7.58,27.75 D1.A
  Bottom 0.25: C9.- 2.56,27.25 2.62,27.25 2.62,28.38 3.12,28.88 R21.2 3.83,28.75 6,28.75 6.38,28.38 6.38,27.12 7.3,26.2 R29.1
N$27
  Bottom 0.25: R28.2 11.32,22.02 Q9.2 9.45,23.97 R29.2
N$30  (via drill 0.5)
  Top 0.25: Q7.3 15.57,27.03 14.92,26.38
  Top 0.33: v14.38,26.38 14.92,26.38
  Bottom 0.25: R20.1 8.8,16.05 9.88,17.12 9.88,19.62 10.75,20.5 11.88,20.5 12.5,21.12 12.5,23.25 12.75,23.5 14.25,23.5 15,24.25 15,25.88 14.5,26.38 v14.38,26.38 14.95,26.38 | R18A.1 16.5,27.92 R18A.1 | R18A.1 R18B.1
  Bottom 0.33: 14.95,26.38 R18A.1
N$36
  Top 0.25: Q8.3 27.48,26.88 25.12,26.88 23.51,25.26 C10.1 | Q7.1 20.16,26.21 21.12,25.25 C10.1 | C10.1 22.83,25.83 23.75,26.75 23.79,26.79 R16.2
N$37
  Top 0.25: 12.23,28.11 D1.C | 17.88,28.38 17.88,27.81 Q7.2 | L1.P$1 12.7,21.2
  Top 0.33: 12.7,21.2 16,24.5 17.38,24.5 17.88,25 Q7.2 | 12.23,28.11 13.12,29 17.25,29 17.88,28.38
N$42
  Bottom 0.25: RPGM.1 19,24.38 20.12,23.25 27,23.25 28.5,24.75 33.12,24.75 35.5,27.12 35.51,27.14 JLVP.1
N$43
  Bottom 0.25: IC3.10 16.25,8.73 16.25,8 13.78,5.53 X1.2 13.78,3.61 CO1.1
N$44
  Bottom 0.25: 17.5,8.75 IC3.9 17.44,8.77 17.44,6.62 X1.1 18.61,3.6 CO2.1
N$45
  Bottom 0.25: CUSB.1 7,6 8,7 10.5,7 11,7.5 11,8.68 IC3.14
N$46
  Bottom 0.25: L3.2 44,17.2 C105.2 43.75,16.49 J1.3
N$47
  Bottom 0.25: C106.1 50.43,15.63 J1.4 48.38,15.68 48.38,16.25 46,18.62 L4.2
N$48
  Bottom 0.25: RL1.1 57.75,20.08 57.75,14.5 57.5,14.25 56.75,14.25 56.25,13.75 56.25,12.88 59.62,9.5 59.62,1 58.88,0.25 28,0.25 25.25,2.88 24.38,2.88 23.75,3.5 23.75,4 23.12,4.62 23.12,6.25 22.5,6.88 21.5,6.88 20.75,7.62 20.5,7.62 20,8.12 IC3.7
N$50  (via drill 0.5)
  Top 0.25: v17.75,12.62 17.75,10.62 19.5,8.88 20.5,8.88 23,6.38 23,1.62 22.38,1 4,1 3.5,1.5 3.5,4.12 3,4.62 S1.3
  Bottom 0.25: RUSR.1 16.05,22.17 13.62,19.75 13.62,19.11 | 13.62,19.11 IC3.17 | 13.62,19.11 13.62,14.25 15.25,12.62 v17.75,12.62
PCLK  (via drill 0.5)
  Top 0.25: IC1.3 21.5,8.75 24,6.25 v24,5
  Bottom 0.25: IC3.6 21.5,8.56 | IC3.6 21.25,8.77 | IC3.6 21.38,8.69 21.38,7.88 21.75,7.5 22.75,7.5 24,6.25 v24,5
PGC  (via drill 0.5)
  Top 0.25: v34.88,24.25 39.25,24.25 40.12,25.12 40.12,28.62 40.62,29.12 50.38,29.12 50.62,28.88 50.62,28.38 51.12,27.88 51.25,27.88 52.38,26.75 52.38,25.62 53.12,24.88 54.88,24.88 K1.3
  Bottom 0.25: IC3.27 26.38,19.11 26.38,20.38 29.5,23.5 34.12,23.5 v34.88,24.25
PGD  (via drill 0.5)
  Top 0.25: v35.88,22.88 36.62,23.75 39.5,23.75 40.62,24.88 40.62,28.38 40.88,28.62 50,28.62 50.12,28.5 50.12,28.12 50.88,27.38 51,27.38 51.88,26.5 51.88,25.38 52.88,24.38 56.91,24.38 K1.5
  Bottom 0.25: 27.8,19.08 IC3.28 27.62,20.5 30,22.88 v35.88,22.88
PGM  (via drill 0.5)
  Top 0.25: K1.4 54.84,27.38 52.88,27.38 v51.5,28.75
  Bottom 0.25: v51.5,28.75 51.12,29.12 38.25,29.12 37.62,28.5 37.62,26.12 37.25,25.75 36.26,25.75 JLVP.2 36,25.49 34.74,25.49 33.38,24.12 29,24.12 25.12,20.25 25.08,20.2 IC3.26
R15
  Top 0.25: IC1.22 28.5,15.75 28.88,15.38 30,15.38 30.38,15.75 32.12,15.75 33.05,15.2
  Top 0.33: 33.05,15.2 R15.2
SCK  (via drill 0.5)
  Top 0.25: v19.62,17.25 IC1.38
  Bottom 0.25: v19.62,17.25 19.62,18 20,18.38 IC3.22
SDCH  (via drill 0.5)
  Top 0.25: 6,20.38 6,19.62 6.5,19.12 6.5,18.62 7.88,17.25 7.88,14.75 9.12,13.5 23.62,13.5 24,13.12 IC1.8 | 6,20.38 6.25,20.62 | 6.25,20.62 v6.25,21.62 | 6,20.38 6.25,20.62
  Bottom 0.25: R19.2 9.42,28.08 10.12,27.38 10.12,25.62 9.75,25.25 7.62,25.25 6.62,24.25 6.62,22 v6.25,21.62
SDCL  (via drill 0.5)
  Top 0.25: v7,20 7,19 8.5,17.5 8.5,14.88 9.38,14 24,14 24.5,13.5 IC1.9
  Bottom 0.25: Q9.3 8.5,18.7 8.12,18.33 R20.2 8.5,18 7.5,19 7.5,19.5 v7,20
SDI  (via drill 0.5)
  Top 0.25: IC1.36 21.5,18.5 21.25,18.75 19.38,18.75 18.5,17.88 v18.5,17.25
  Bottom 0.25: v18.5,17.25 18.5,18.85 IC3.21
SDO  (via drill 0.5)
  Top 0.25: IC1.37 21,16 20.75,15.75 19.75,15.75 19.38,16.12 v16.38,16.12
  Bottom 0.25: 15,19 IC3.18 14.88,19.04 14.88,16.75 15.5,16.12 v16.38,16.12
SRINGDC  (via drill 0.5)
  Top 0.25: R3.1 38.05,2 52.25,2 52.88,2.62 52.88,7 53.38,7.5 53.5,7.62 54.5,7.62 v55.25,6.88
  Bottom 0.25: L4.1 46,22.34 C4.1 48.73,22.84 C6.1 50.62,20.88 55,16.5 55,12.62 56.75,10.88 56.75,8.38 v55.25,6.88 55.25,6.75 54,5.5 53.38,5.5 52.5,6.38 52.5,6.88 50.5,8.88 IC2.3
SRINGE  (via drill 0.5)
  Top 0.25: 34.75,10 v34.75,9.25 34.75,10 | 34.75,10 34,10.75 R4.1 | 34.75,10 35.5,10.75 35.88,10.75 36.42,11.3 R7.2
  Bottom 0.25: IC2.10 36.17,3.83 34.75,5.25 v34.75,9.25
STIPDC  (via drill 0.5)
  Top 0.25: R1.1 35,2 35.5,1.5 52.5,1.5 53.75,2.75 v53.75,6.5
  Bottom 0.25: C5.2 41,22.62 41.25,22.88 42.97,22.88 C3.1 44,22.84 L3.1 42.79,21.04 42.38,20.62 42.38,15.88 41.62,15.12 40.88,15.12 40.38,14.62 40.38,13.88 41.25,13 46.62,13 48.25,11.38 49.01,11.38 | 49.01,11.38 IC2.1 | 49.01,11.38 50.12,11.5 53,8.62 53,7.25 v53.75,6.5
STIPE  (via drill 0.5)
  Top 0.25: 39.05,3 R2.1 40.42,3.05 41,3.62 v41,5 41,6 R6.2
  Bottom 0.25: v41,5 42.83,5 IC2.11
VANALOG  (via drill 0.5 pad 1.02, 0.6 pad 1.27)
  Top 0.25: IC1.27 26,19.5 27.25,20.75 | 28.9,20.65 C16.2 29.02,20.75 27.25,20.75 | IC1.10 25,11.88 25.75,12.62 v26.5,12.62 | 30.96,13.25 C15.2 30.83,13.38 | 29.12,20.75 27.25,20.75
  Top 0.33: v29.12,13.38 30.83,13.38 | 29.12,20.75 29.75,20.75 30.12,21.12 32.38,21.12 32.75,20.75 32.75,19.25 33.12,18.88 35.12,18.88 36.12,17.88 v37.75,17.88 38.25,17.38 38.25,15.88 38.62,15.5 38.88,15.5 39.5,14.88 39.5,14 38.75,13.25 38.75,13.12 | C15.2 31.04,13.25 38.25,13.25 38.62,13.25 38.75,13.12 | 38.75,13.12 40.88,11 40.88,8.88 42.5,7.25 42.5,4 43,3.5 v46,3.5
  Bottom 0.33: v29.12,13.38 28.88,13.12 27.12,13.12 27,13.12 v26.5,12.62 | v46,3.5 46.95,2.56 IC2.8 51.15,2.56 C24.1 | L2.2 C31.2 34.95,19.05 36.12,17.88 v37.75,17.88
VBAT  (via drill 0.5)
  Top 0.25: v10,15 10.38,15 10.88,14.5 25.62,14.5 26.62,13.5 26.88,13.5 27.12,13.25 28,13.25 28.88,12.38 32,12.38 32.38,12.75 37.12,12.75 38.33,11.55 R7.1 38.33,10.79 | 38.33,10.79 R5.1 | 38.33,10.79 39.47,9.65 R6.1 41.88,7.04 41.88,3.62 43,2.5 51.62,2.5 52,2.88 v52,5.62
  Bottom 0.25: R21.1 1.05,28.05 0.5,27.5 0.5,25 0.5,24.91 0.5,24.88 1.38,24 C26.2 2,24 0.5,22.5 0.5,19.25 1.25,18.5 3.62,18.5 4.75,17.38 6.38,17.38 6.88,16.88 6.88,15.38 7.25,15 v10,15 | IC2.4 IC2.5 51.25,6.38 v52,5.62
VUNREG  (via drill 0.5)
  Top 0.25: 21.88,28.01 R16.1 | 32.65,27.35 C14.2
  Top 0.33: 21.88,28.01 22.62,28.75 v25.5,28.75 31.25,28.75 32.65,27.35
  Bottom 0.25: 13.92,28.67 13.92,28.5 R18A.2 13.88,28 13.25,27.38 | 21.62,28.62 21.62,28.05 R18B.2 | 25.5,28.5 v25.5,28.75
  Bottom 0.33: 13.92,28.67 14.75,29.5 20.75,29.5 21.62,28.62 | 13.92,28.5 R19.1 | R18B.2 F1.1 25,28 25.5,28.5 | C25.+ 13.25,25.32 13.25,27.38

### Text on the board
tPlace: version: 2.1d | Open USB FXS | (C)2010 | A.Varvitsiotis